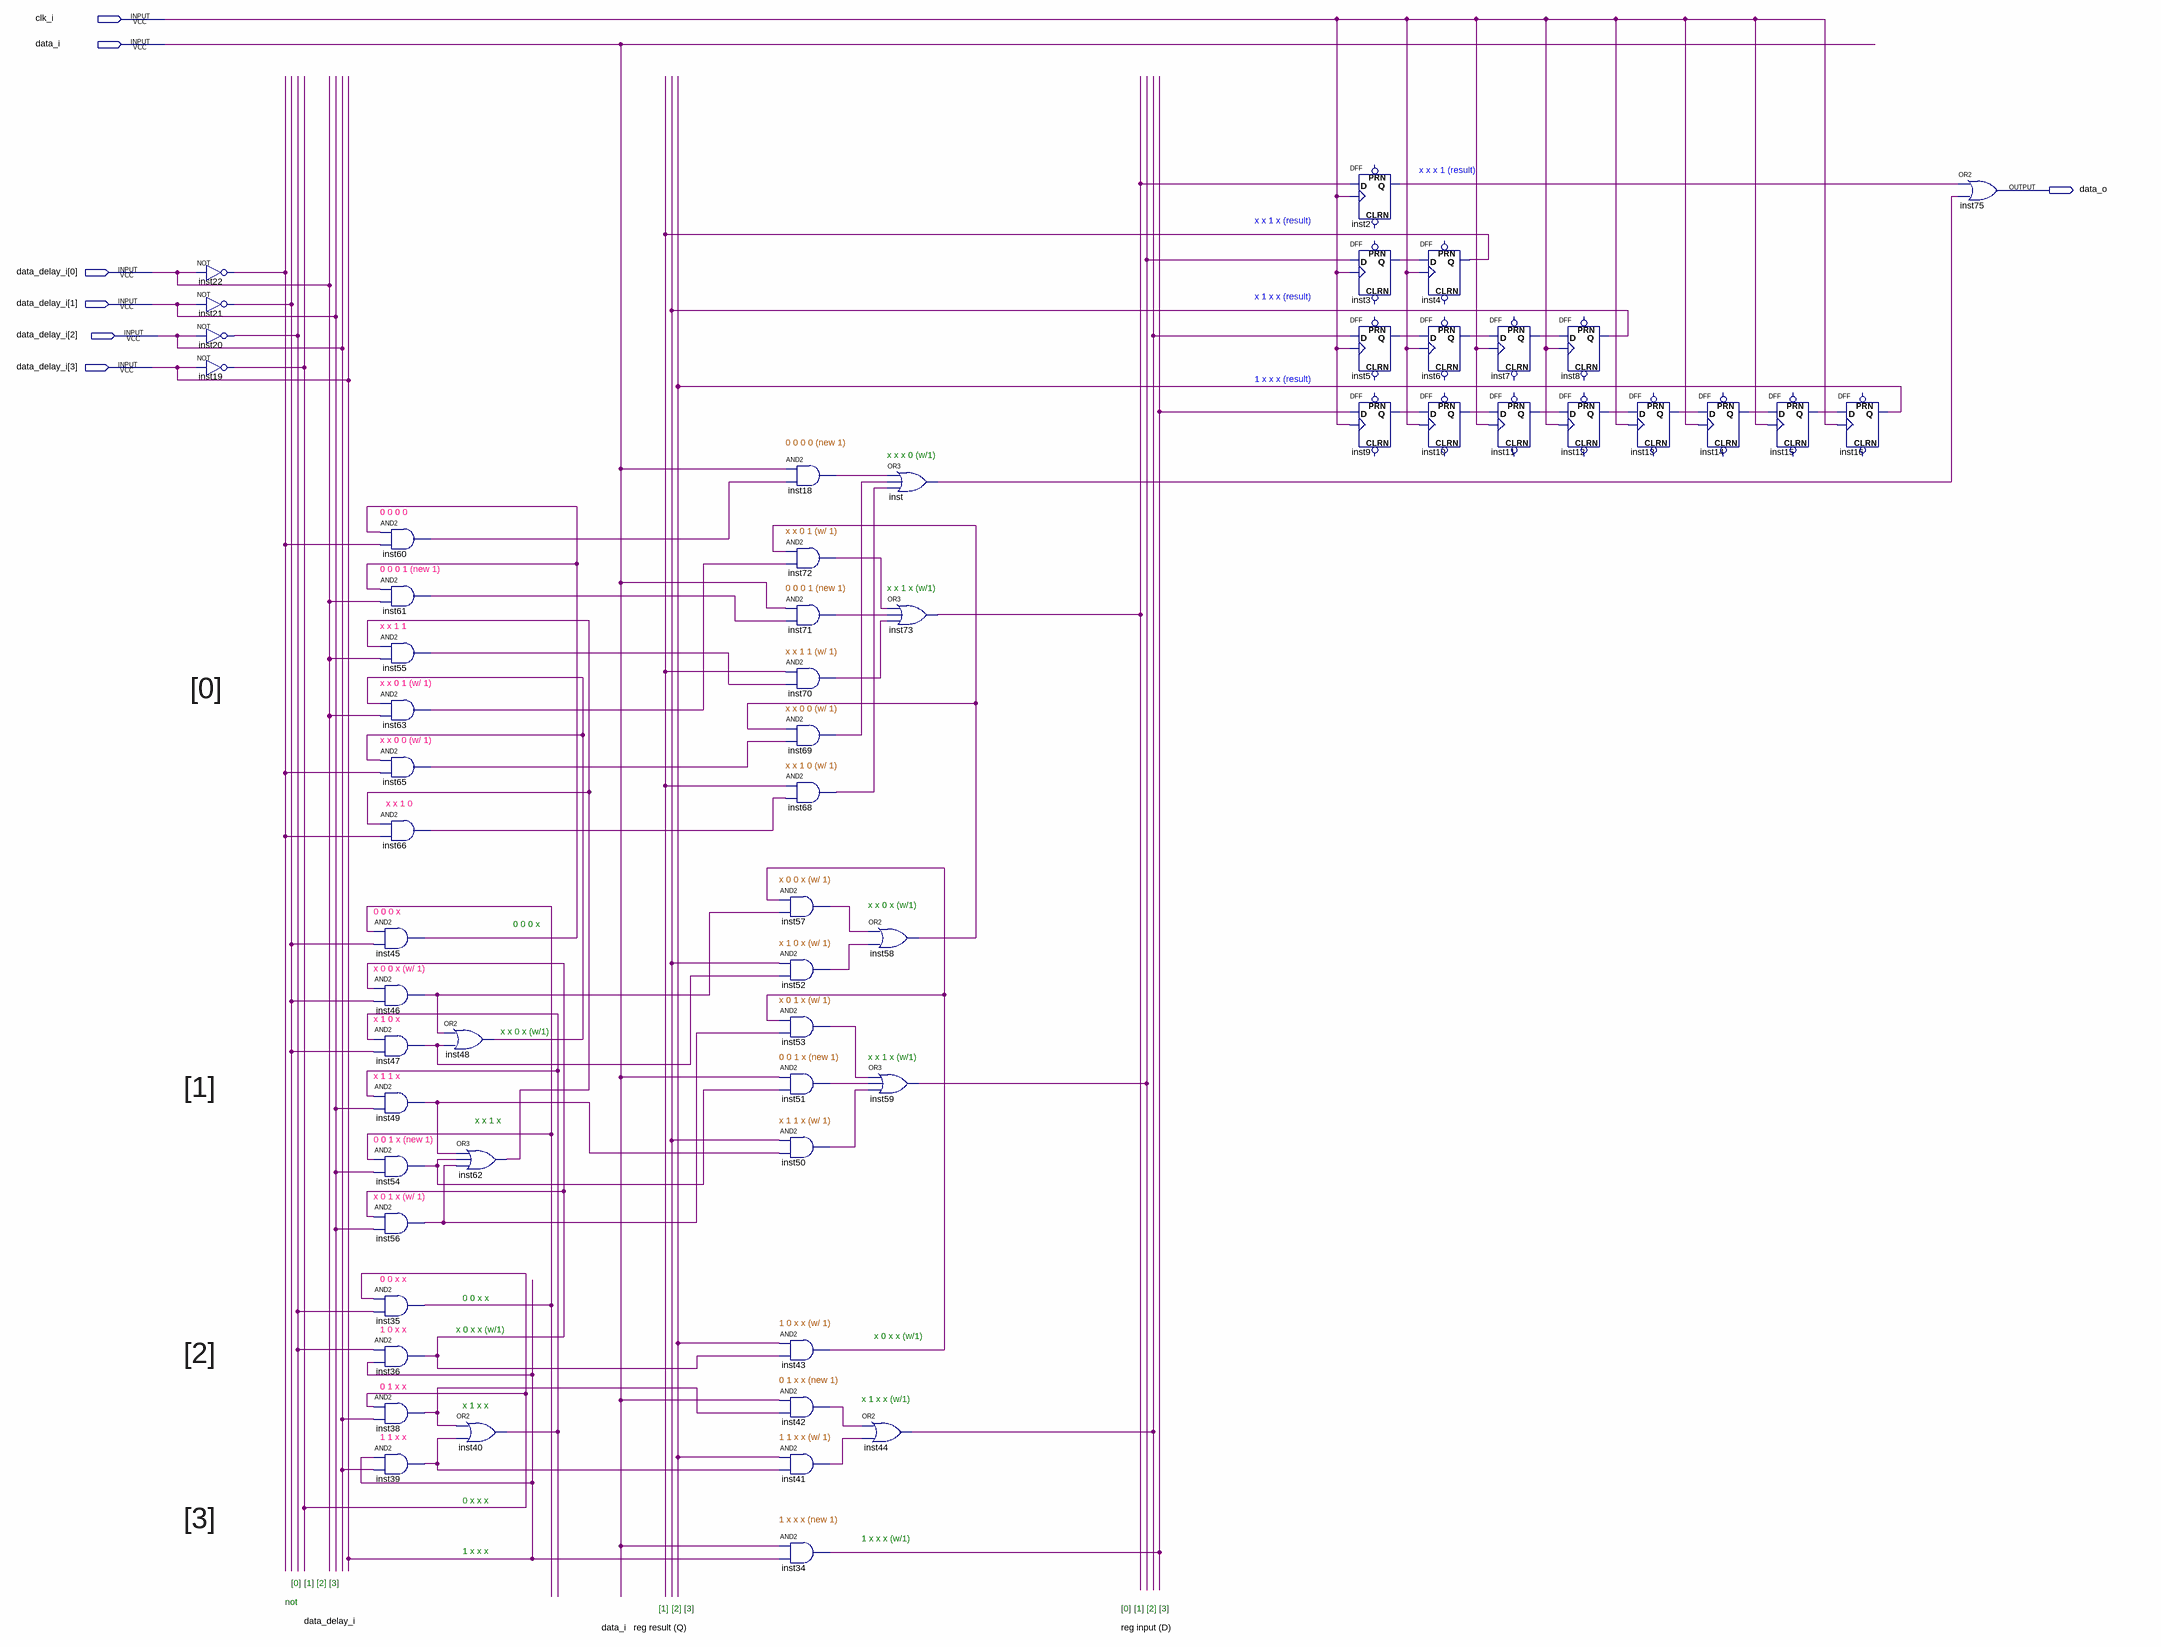
[diagram p0: schematic sheet]
// Quartus schematic delay_15.bdf as structural Verilog: 59 symbols, 7 pins
module delay_15 (
  input  clk_i,
  input  data_i,
  input  [3:0] data_delay_i,
  output data_o
);

  wire inst2_q, inst3_q, inst4_q, inst5_q, inst6_q, inst7_q, inst8_q, inst9_q, inst10_q, inst11_q, inst12_q,
       inst13_q, inst14_q, inst15_q, inst16_q, inst18_out, inst19_out, inst20_out, inst21_out, inst22_out,
       inst34_out, inst35_out, inst36_out, inst38_out, inst39_out, inst40_out, inst41_out, inst42_out,
       inst43_out, inst44_out, inst45_out, inst46_out, inst47_out, inst48_out, inst49_out, inst50_out,
       inst51_out, inst52_out, inst53_out, inst54_out, inst55_out, inst56_out, inst57_out, inst58_out,
       inst59_out, inst60_out, inst61_out, inst62_out, inst63_out, inst65_out, inst66_out, inst68_out,
       inst69_out, inst70_out, inst71_out, inst72_out, inst73_out, inst_out;

  not inst22 (inst22_out, data_delay_i[0]);
  not inst21 (inst21_out, data_delay_i[1]);
  not inst20 (inst20_out, data_delay_i[2]);
  not inst19 (inst19_out, data_delay_i[3]);
  and inst60 (inst60_out, inst45_out, inst22_out);
  and inst61 (inst61_out, inst45_out, data_delay_i[0]);
  and inst55 (inst55_out, inst62_out, data_delay_i[0]);
  and inst63 (inst63_out, inst48_out, data_delay_i[0]);
  and inst65 (inst65_out, inst48_out, inst22_out);
  and inst66 (inst66_out, inst62_out, inst22_out);
  and inst45 (inst45_out, inst35_out, inst21_out);
  and inst46 (inst46_out, inst36_out, inst21_out);
  and inst47 (inst47_out, inst40_out, inst21_out);
  and inst49 (inst49_out, inst40_out, data_delay_i[1]);
  and inst54 (inst54_out, inst35_out, data_delay_i[1]);
  and inst56 (inst56_out, inst36_out, data_delay_i[1]);
  and inst35 (inst35_out, inst19_out, inst20_out);
  and inst36 (inst36_out, inst20_out, data_delay_i[3]);
  and inst38 (inst38_out, inst19_out, data_delay_i[2]);
  and inst39 (inst39_out, data_delay_i[3], data_delay_i[2]);
  or inst48 (inst48_out, inst46_out, inst47_out);
  or inst62 (inst62_out, inst49_out, inst54_out, inst56_out);
  or inst40 (inst40_out, inst38_out, inst39_out);
  and inst18 (inst18_out, data_i, inst60_out);
  and inst72 (inst72_out, inst58_out, inst63_out);
  and inst71 (inst71_out, data_i, inst61_out);
  and inst70 (inst70_out, inst4_q, inst55_out);
  and inst69 (inst69_out, inst58_out, inst65_out);
  and inst68 (inst68_out, inst4_q, inst66_out);
  and inst57 (inst57_out, inst43_out, inst46_out);
  and inst52 (inst52_out, inst8_q, inst47_out);
  and inst53 (inst53_out, inst43_out, inst56_out);
  and inst51 (inst51_out, data_i, inst54_out);
  and inst50 (inst50_out, inst8_q, inst49_out);
  and inst43 (inst43_out, inst16_q, inst36_out);
  and inst42 (inst42_out, data_i, inst38_out);
  and inst41 (inst41_out, inst16_q, inst39_out);
  and inst34 (inst34_out, data_i, data_delay_i[3]);
  or inst (inst_out, inst18_out, inst69_out, inst68_out);
  or inst73 (inst73_out, inst72_out, inst71_out, inst70_out);
  or inst58 (inst58_out, inst57_out, inst52_out);
  or inst59 (inst59_out, inst53_out, inst51_out, inst50_out);
  or inst44 (inst44_out, inst42_out, inst41_out);
  DFF inst2 (.CLK(clk_i), .D(inst73_out), .Q(inst2_q));  // open: CLRN, PRN
  DFF inst3 (.CLK(clk_i), .D(inst59_out), .Q(inst3_q));  // open: CLRN, PRN
  DFF inst5 (.CLK(clk_i), .D(inst44_out), .Q(inst5_q));  // open: CLRN, PRN
  DFF inst9 (.CLK(clk_i), .D(inst34_out), .Q(inst9_q));  // open: CLRN, PRN
  DFF inst4 (.CLK(clk_i), .D(inst3_q), .Q(inst4_q));  // open: CLRN, PRN
  DFF inst6 (.CLK(clk_i), .D(inst5_q), .Q(inst6_q));  // open: CLRN, PRN
  DFF inst10 (.CLK(clk_i), .D(inst9_q), .Q(inst10_q));  // open: CLRN, PRN
  DFF inst7 (.CLK(clk_i), .D(inst6_q), .Q(inst7_q));  // open: CLRN, PRN
  DFF inst11 (.CLK(clk_i), .D(inst10_q), .Q(inst11_q));  // open: CLRN, PRN
  DFF inst8 (.CLK(clk_i), .D(inst7_q), .Q(inst8_q));  // open: CLRN, PRN
  DFF inst12 (.CLK(clk_i), .D(inst11_q), .Q(inst12_q));  // open: CLRN, PRN
  DFF inst13 (.CLK(clk_i), .D(inst12_q), .Q(inst13_q));  // open: CLRN, PRN
  DFF inst14 (.CLK(clk_i), .D(inst13_q), .Q(inst14_q));  // open: CLRN, PRN
  DFF inst15 (.CLK(clk_i), .D(inst14_q), .Q(inst15_q));  // open: CLRN, PRN
  DFF inst16 (.CLK(clk_i), .D(inst15_q), .Q(inst16_q));  // open: CLRN, PRN
  or inst75 (data_o, inst2_q, inst_out);

  // Notes on the sheet:
  //   x x x 1 (result)
  //   x x 1 x (result)
  //   x 1 x x (result)
  //   1 x x x (result)
  //   0 0 0 0 (new 1)
  //   x x x 0 (w/1)
  //   0 0 0 0
  //   x x 0 1 (w/ 1)
  //   0 0 0 1 (new 1)
  //   0 0 0 1 (new 1)
  //   x x 1 x (w/1)
  //   x x 1 1
  //   x x 1 1 (w/ 1)
  //   [0]
  //   x x 0 1 (w/ 1)
  //   x x 0 0 (w/ 1)
  //   x x 0 0 (w/ 1)
  //   x x 1 0 (w/ 1)
  //   x x 1 0
  //   x 0 0 x (w/ 1)
  //   x x 0 x (w/1)
  //   0 0 0 x
  //   0 0 0 x
  //   x 1 0 x (w/ 1)
  //   x 0 0 x (w/ 1)
  //   x 0 1 x (w/ 1)
  //   x 1 0 x
  //   x x 0 x (w/1)
  //   0 0 1 x (new 1)
  //   x x 1 x (w/1)
  //   [1]
  //   x 1 1 x
  //   x x 1 x
  //   x 1 1 x (w/ 1)
  //   0 0 1 x (new 1)
  //   x 0 1 x (w/ 1)
  //   0 0 x x
  //   0 0 x x
  //   1 0 x x (w/ 1)
  //   1 0 x x
  //   x 0 x x (w/1)
  //   x 0 x x (w/1)
  //   [2]
  //   0 1 x x (new 1)
  //   0 1 x x
  //   x 1 x x (w/1)
  //   x 1 x x
  //   1 1 x x
  //   1 1 x x (w/ 1)
  //   0 x x x
  //   [3]
  //   1 x x x (new 1)
  //   1 x x x (w/1)
  //   1 x x x
  //   [0]
  //   [1]
  //   [2]
  //   [3]
  //   not
  //   [1]
  //   [2]
  //   [3]
  //   [0]
  //   [1]
  //   [2]
  //   [3]
  //   data_delay_i
  //   data_i
  //   reg result (Q)
  //   reg input (D)
endmodule
